# EAGLE design 6WLS-40W (EAGLE 7.4.0)
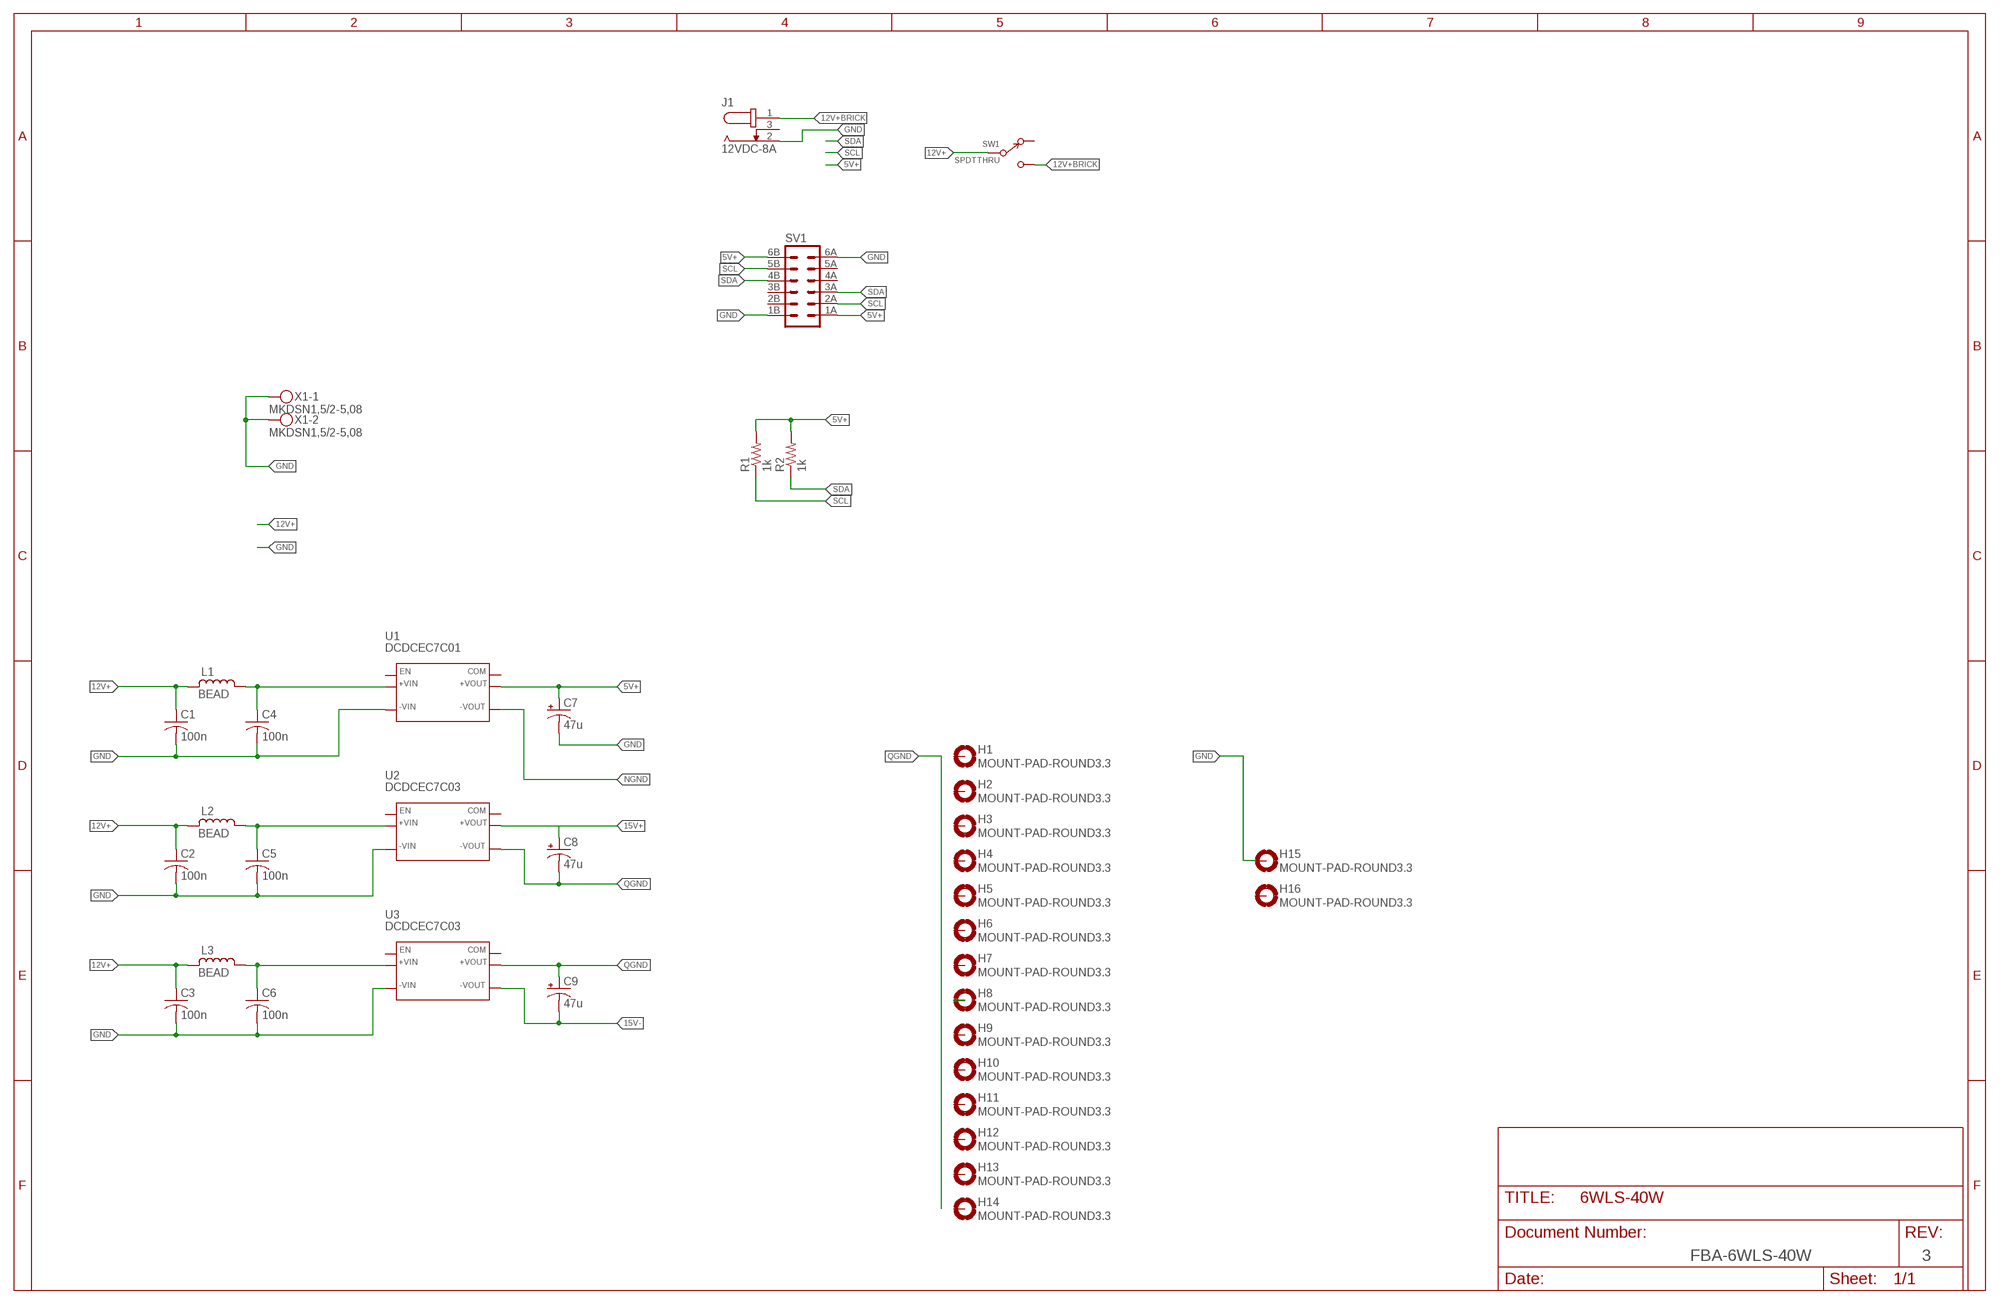
[diagram p0: schematic, sheet 1]

## Parts
C1  100n  C-US050-025X075  [C050-025X075]
C2  100n  C-US050-025X075  [C050-025X075]
C3  100n  C-US050-025X075  [C050-025X075]
C4  100n  C-US050-025X075  [C050-025X075]
C5  100n  C-US050-025X075  [C050-025X075]
C6  100n  C-US050-025X075  [C050-025X075]
C7  47u  CPOL-USE5-6  [E5-6]
C8  47u  CPOL-USE5-6  [E5-6]
C9  47u  CPOL-USE5-6  [E5-6]
H1  MOUNT-PAD-ROUND3.3  [3,3-PAD]
H2  MOUNT-PAD-ROUND3.3  [3,3-PAD]
H3  MOUNT-PAD-ROUND3.3  [3,3-PAD]
H4  MOUNT-PAD-ROUND3.3  [3,3-PAD]
H5  MOUNT-PAD-ROUND3.3  [3,3-PAD]
H6  MOUNT-PAD-ROUND3.3  [3,3-PAD]
H7  MOUNT-PAD-ROUND3.3  [3,3-PAD]
H8  MOUNT-PAD-ROUND3.3  [3,3-PAD]
H9  MOUNT-PAD-ROUND3.3  [3,3-PAD]
H10  MOUNT-PAD-ROUND3.3  [3,3-PAD]
H11  MOUNT-PAD-ROUND3.3  [3,3-PAD]
H12  MOUNT-PAD-ROUND3.3  [3,3-PAD]
H13  MOUNT-PAD-ROUND3.3  [3,3-PAD]
H14  MOUNT-PAD-ROUND3.3  [3,3-PAD]
H15  MOUNT-PAD-ROUND3.3  [3,3-PAD]
H16  MOUNT-PAD-ROUND3.3  [3,3-PAD]
J1  12VDC-8A  BARREL55  [BARREL]
L1  BEAD  L  [BEAD]
L2  BEAD  L  [BEAD]
L3  BEAD  L  [BEAD]
R1  1k  R-US_0207/7  [0207/7]
R2  1k  R-US_0207/7  [0207/7]
SV1  MA06-2CARD  [EBC06DRAS]
SW1  SPDTTHRU  [SPDT-THRU]
U1  DCDCEC7C01  [EC7C]
U2  DCDCEC7C03  [EC7C]
U3  DCDCEC7C03  [EC7C]
X1  MKDSN1,5/2-5,08  [MKDSN1,5/2-5,08]

## Nets
5V+: C7.+ R1.2 R2.2 SV1.1A SV1.6B U1.S+(+VOUT) U1.VO+(+VOUT)
12V+: C1.1 C2.1 C3.1 L1.1 L2.1 L3.1 SW1.C
12V+BRICK: J1.1 SW1.1
15V+: C8.+ U2.S+(+VOUT) U2.VO+(+VOUT)
15V-: C9.- U3.S-(-VOUT) U3.VO-(-VOUT)
GND: C1.2 C2.2 C3.2 C4.2 C5.2 C6.2 C7.- H15.B3,3(MOUNT) J1.2 SV1.1B SV1.6A U1.VIN-(-VIN) U2.VIN-(-VIN) U3.VIN-(-VIN) X1.1 X1.2
N$1: C5.1 L2.2 U2.VIN+(+VIN)
N$2: C6.1 L3.2 U3.VIN+(+VIN)
N$3: C4.1 L1.2 U1.VIN+(+VIN)
N$5: H8.B3,3(MOUNT)
NGND: U1.S-(-VOUT) U1.VO-(-VOUT)
QGND: C8.- C9.+ U2.S-(-VOUT) U2.VO-(-VOUT) U3.S+(+VOUT) U3.VO+(+VOUT)
SCL: R1.1 SV1.2A SV1.5B
SDA: R2.1 SV1.3A SV1.4B
Unconnected: H1.B3,3(MOUNT) H2.B3,3(MOUNT) H3.B3,3(MOUNT) H4.B3,3(MOUNT) H5.B3,3(MOUNT) H6.B3,3(MOUNT) H7.B3,3(MOUNT) H9.B3,3(MOUNT) H10.B3,3(MOUNT) H11.B3,3(MOUNT) H12.B3,3(MOUNT) H13.B3,3(MOUNT) H14.B3,3(MOUNT) H16.B3,3(MOUNT) J1.3 SV1.2B SV1.3B SV1.4A SV1.5A SW1.2 U1.ONOFF(EN) U2.ONOFF(EN) U3.ONOFF(EN)

## Notes on the sheet
- FBA-6WLS-40W | 3

## Power pins joined to a net without a drawn wire
COM: U1.NC(COM) U2.NC(COM) U3.NC(COM)

## Library data of the parts
C1-C6 = resistor:C-US: CAPACITOR, American symbol
C7-C9 = resistor:CPOL-US: POLARIZED CAPACITOR, American symbol
H1-H16 = holes:MOUNT-PAD-ROUND: MOUNTING PAD, round
J1 = studio_h:BARREL: DC POWER JACK Power Jack, DC, Right Angle, Through Hole 8A; MF: TENSILITY; MPN: 54-00167; Z_DIGIKEY: 839-54-00167-ND; Z_SMT: N
L1-L3 = studio_h:L: Inductor; MF: LAIRD; MPN: 28L0138-80R-10; Z_DIGIKEY: 240-2513-2-ND; Z_SMT: N
R1 R2 = resistor:R-US_: RESISTOR, American symbol
SV1 = studio_h:MA06-2: PIN HEADER; MF: SULLINS; MPN: EBC06DRAS; Z_DIGIKEY: S3294-ND
SW1 = studio_h:SPDT: SPDT Switch; MF: NKK; MPN: MS13ASG30; Z_DIGIKEY: MS13ASG30-ND
U1-U3 = studio_h:DCDC: DCDC Converter
X1 = con-phoenix-508:MKDSN1,5/2-5,08: MKDSN 1,5/ 2-5,08 Printklemme Nennstrom: 13,5 A Nennspannung: 250 V Rastermaß: 5,08 mm Polzahl: 2 Anschlussart: Schraubanschluss Montage: Löten Anschlussrichtung Leiter/Platine: 0 ° Artikelnummer: 1729128 Source: http://eshop.phoenixcontact.com .. 1729128.pdf

## Net classes
0 Signal: width 0.254 mm, clearance 0.205 mm
1 Power: width 0.508 mm, clearance 0.205 mm to class 0, clearance 0.205 mm
2 GND: width 0.889 mm

## Board
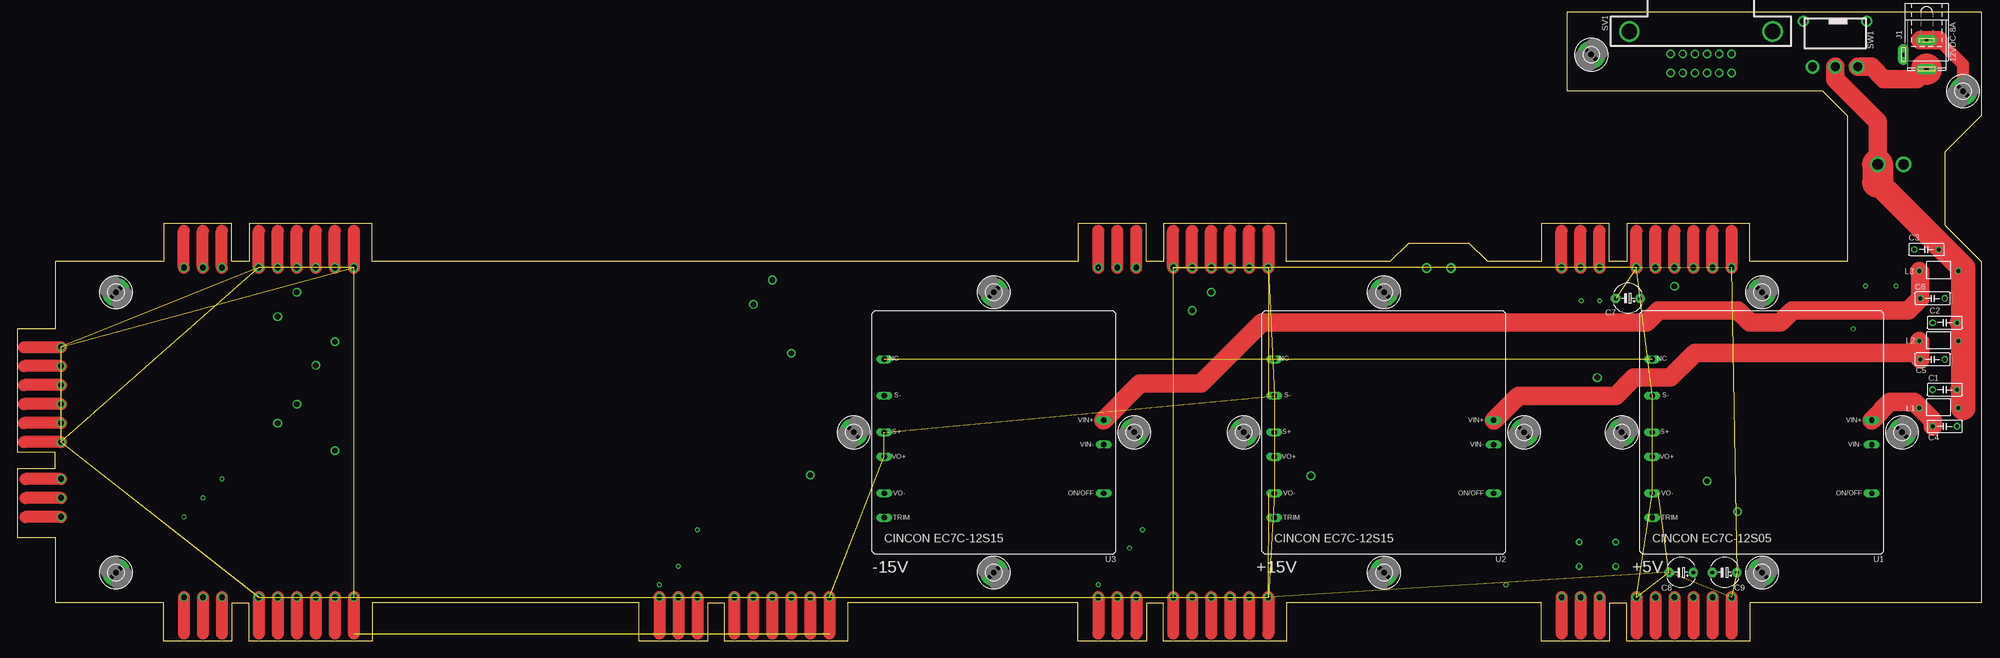
[diagram p1: board, top side]
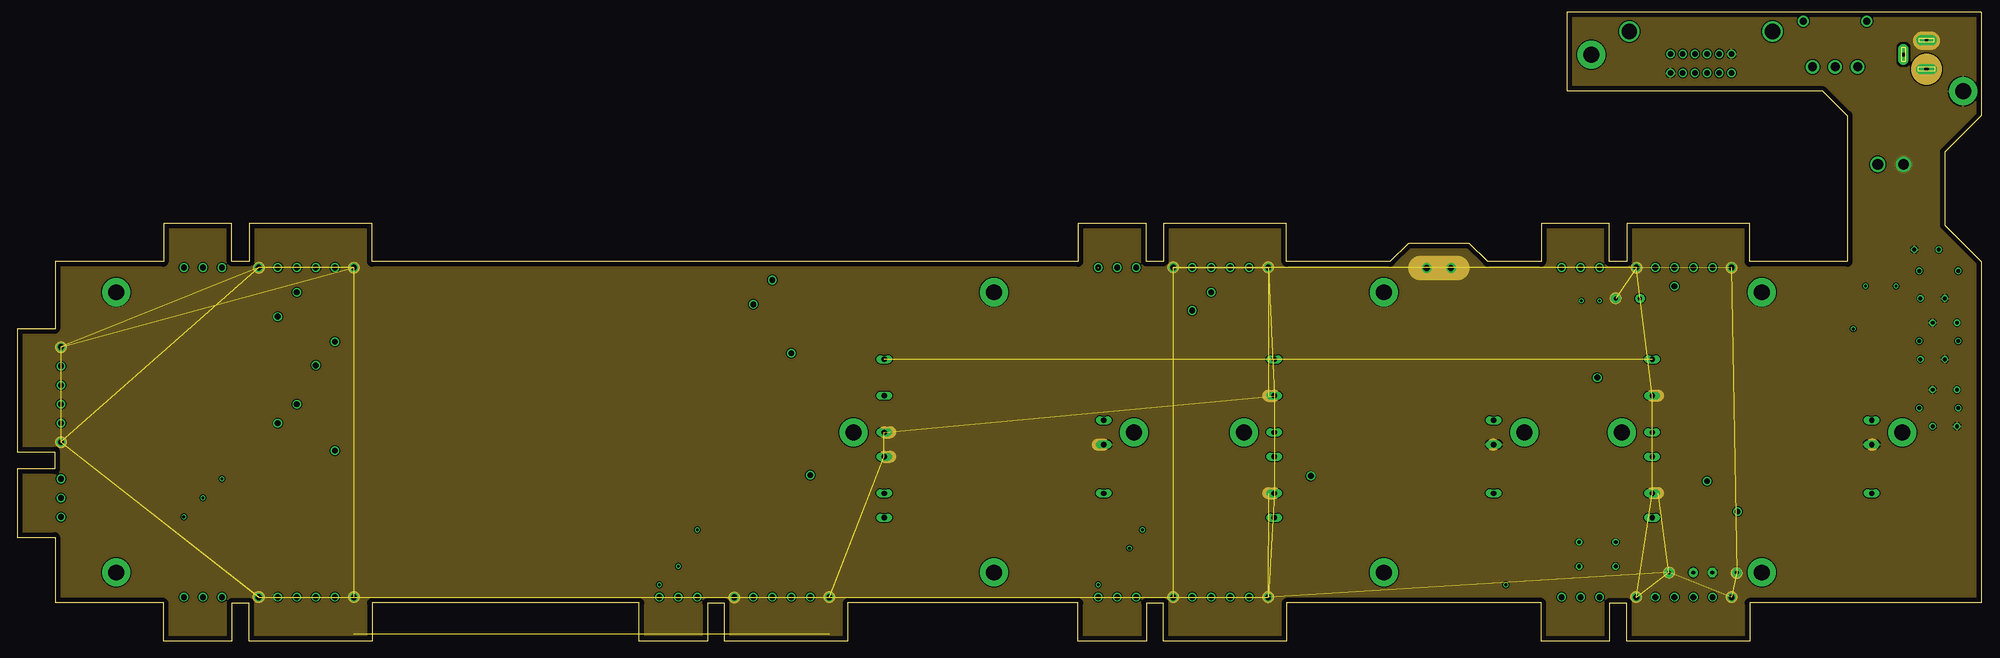
[diagram p2: board, inner layer Route2]
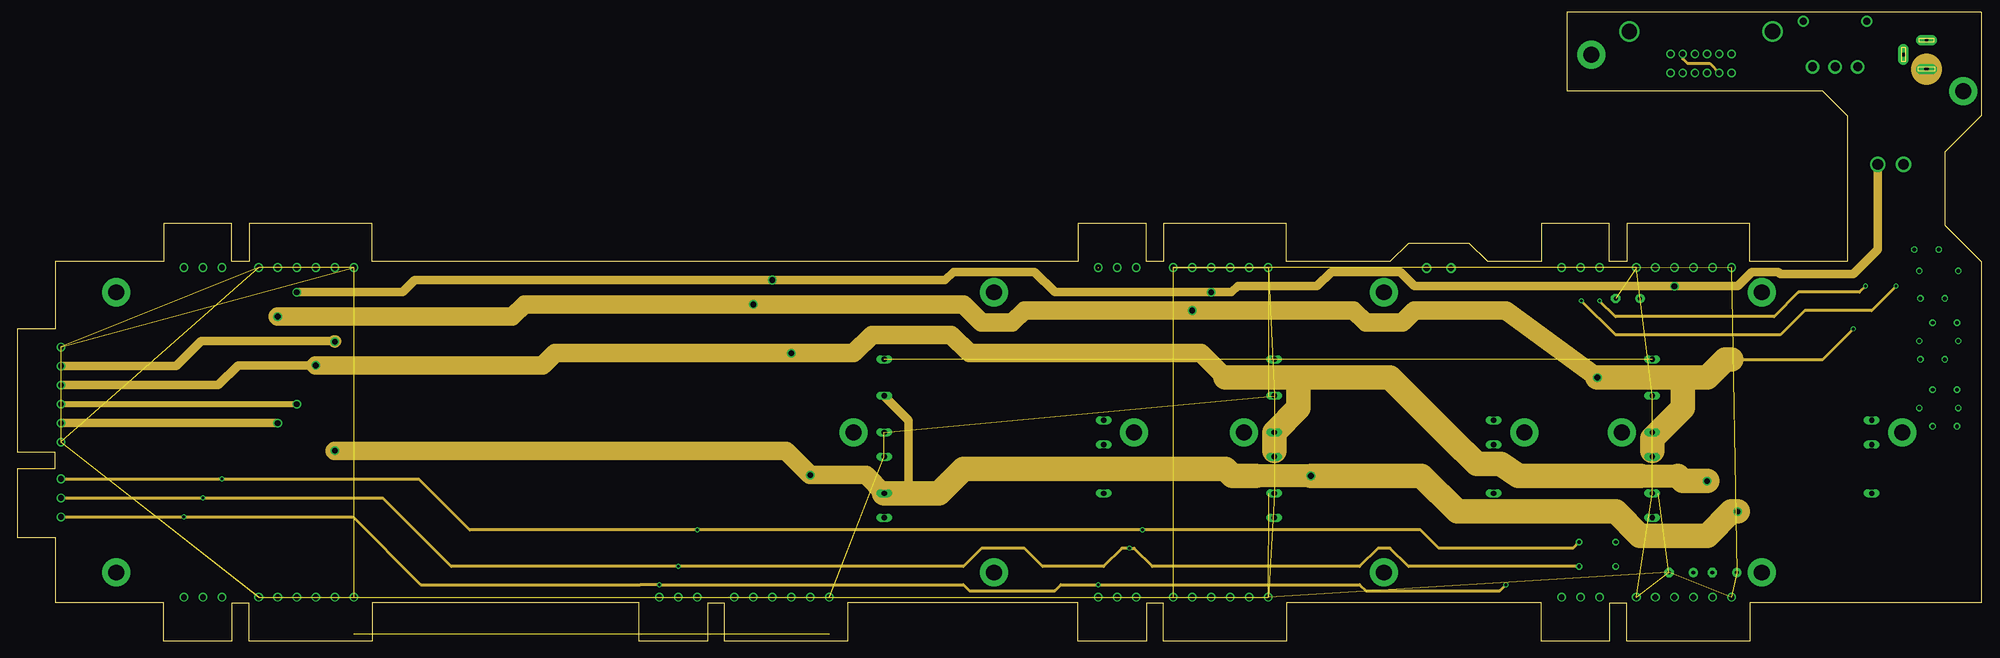
[diagram p3: board, inner layer Route15]
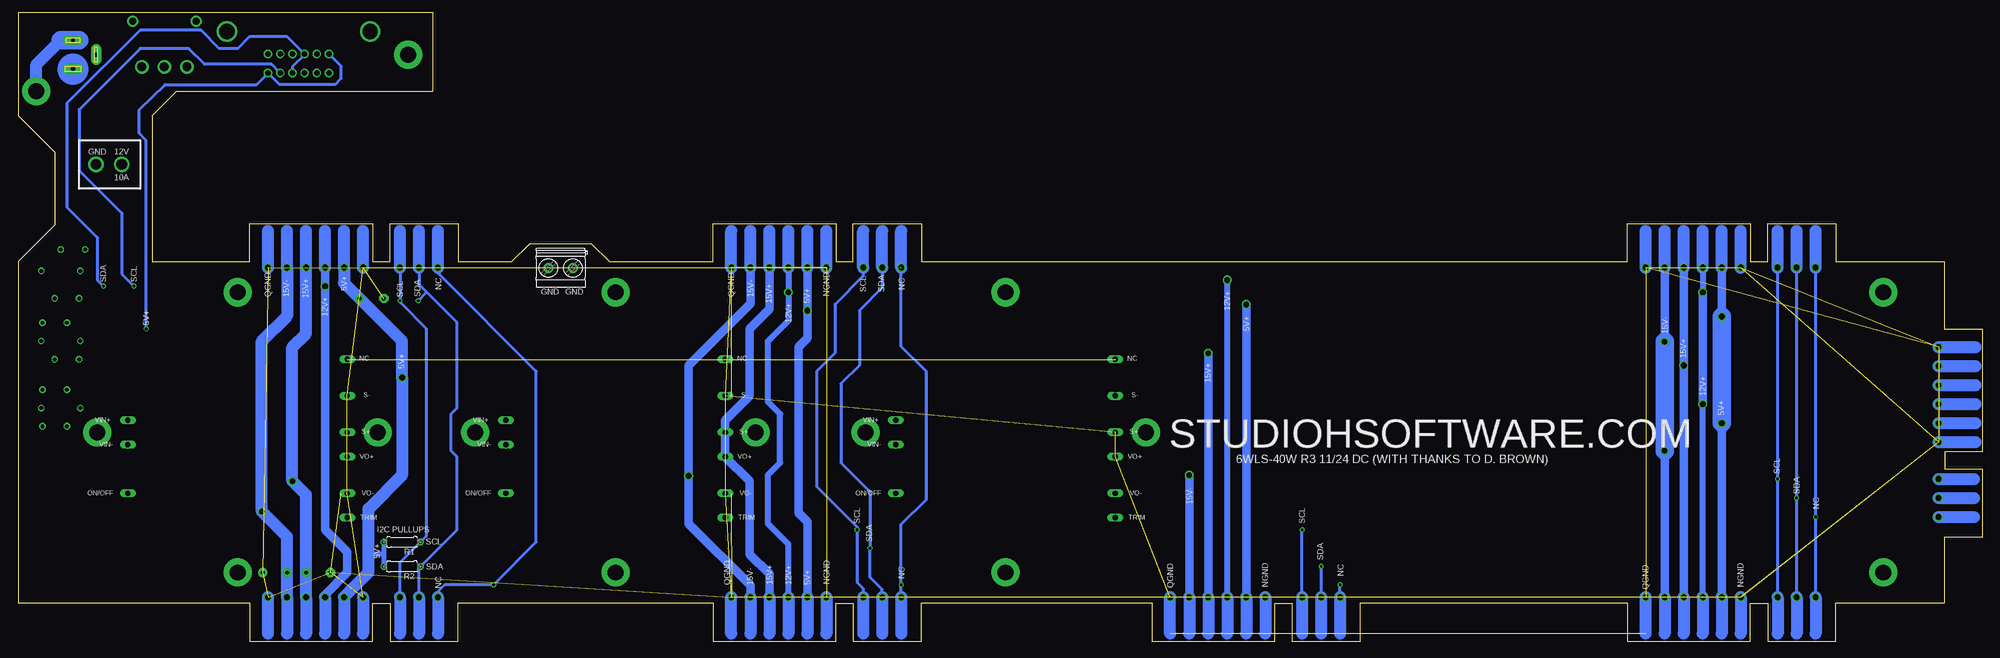
[diagram p4: board, bottom side, seen from below]

Size 409.26 x 131.13 mm. Coordinates in mm from the lower left corner, seen from the top.
Outline: 73.98,7.94 73.98,0 48.32,0 48.32,7.87 44.77,7.87 44.77,0 30.54,0 30.54,7.94 7.94,7.94 7.94,21.65 0,21.65 0,35.88 7.87,35.88 7.87,39.43 0,39.43 0,65.09 7.94,65.09 7.94,79.06 30.54,79.06 30.54,87 44.77,87 44.77,79.12 48.32,79.12 48.32,87 73.98,87 73.98,79.06 221.04,79.06 221.04,87 235.27,87 235.27,79.12 238.82,79.12 238.82,87 264.48,87 264.48,79.06 286.07,79.06 289.88,82.87 302.58,82.87 306.39,79.06 317.56,79.06 317.56,87 331.79,87 331.79,79.12 335.34,79.12 335.34,87 361,87 361,79.06 381.32,79.06 381.32,109.54 376.24,114.62 322.9,114.62 322.9,131.13 409.26,131.13 409.26,109.54 401.64,101.92 401.64,86.68 409.26,79.06 409.26,7.94 361,7.94 361,0 335.34,0 335.34,7.87 331.79,7.87 331.79,0 317.56,0 317.56,7.94 264.48,7.94 264.48,0 238.82,0 238.82,7.87 235.27,7.87 235.27,0 221.04,0 221.04,7.94 173.04,7.94 173.04,0 147.38,0 147.38,7.87 143.83,7.87 143.83,0 129.6,0 129.6,7.94 73.98,7.94
Copper layers (1*2*15*16): Top 0.035mm / dielectric 0.2mm / Route2 0.035mm / dielectric 1mm / Route15 0.035mm / dielectric 0.2mm / Bottom 0.035mm
Design rules "default *": minimum track width 10mil, minimum drill 20mil, track to track 8mil, track to pad 8mil, pad to pad 8mil, via to via 8mil, smd to smd 8mil, copper to edge 40mil, drill to drill 8mil, minimum pad ring 10mil, minimum via ring 8mil, stop-mask expansion 4mil, vias tented up to drill 0mil, thermal gap 10mil

### Footprints (pad centres in the part's own frame; a part is rotated, then mirrored left to right if it is on the bottom)
C050-025X075 = drill 0.813 octagon: 1 -2.54,0; 2 2.54,0
E5-6 = drill 0.813 pad 1.905: + -2.54,0 | drill 0.813 pad 1.905 octagon: - 2.54,0
3,3-PAD = drill 3.3 pad 5.842: B3,3 0,0
BARREL = drill 1 pad 2.184 long: 1 6.81,0 | drill 0.8 pad 2.184 long: 2 0.81,0; 3 3.81,-4.8
BEAD = drill 0.813: 1 -4.064,0; 2 4.064,0
0207/7 = drill 0.813 octagon: 1 -3.81,0; 2 3.81,0
EBC06DRAS = drill 1.143: 1A -6.35,-6.223; 1B -6.35,-10.185; 2A -3.81,-6.223; 2B -3.81,-10.185; 3A -1.27,-6.223; 3B -1.27,-10.185; 4A 1.27,-6.223; 4B 1.27,-10.185; 5A 3.81,-6.223; 5B 3.81,-10.185; 6A 6.35,-6.223; 6B 6.35,-10.185 | drill 3.175: M1 -14.935,-1.524; M2 14.91,-1.524
SPDT-THRU = drill 1.854: 1 4.699,-6.35; 2 -4.699,-6.35; C 0,-6.35 | drill 1.499: P$4 6.604,3.175; P$5 -6.604,3.175
EC7C = drill 1.1 long: NC 22.86,-16.51; ONOFF -22.86,11.43; S+ 22.86,-1.27; S- 22.86,-8.89; TRIM 22.86,16.51; VIN+ -22.86,-3.81; VIN- -22.86,1.27; VO+ 22.86,3.81; VO- 22.86,11.43
MKDSN1,5/2-5,08 = drill 1.3 pad 2: 1 -2.561,0.025; 2 2.519,0.025

### Placement (x,y rotation side)
C1  401.64,52.39 180 top
C2  401.64,66.36 180 top
C3  397.83,81.6 180 top
C4  401.64,44.77 0 top
C5  399.1,58.74 0 top
C6  399.1,71.44 0 top
C7  335.6,71.44 180 top
C8  346.72,14.29 180 top
C9  355.77,14.29 180 top
H1  203.52,72.71 270 top
H2  203.52,14.29 270 top
H3  20.64,72.71 270 top
H4  20.64,14.29 270 top
H5  334.33,43.5 0 top
H6  314.01,43.5 0 top
H7  284.8,72.71 0 top
H8  284.8,14.29 0 top
H9  363.54,72.71 0 top
H10  363.54,14.29 0 top
H11  255.59,43.5 0 top
H12  232.73,43.5 0 top
H13  174.31,43.5 0 top
H14  392.75,43.5 0 top
H15  405.45,114.62 0 top
H16  327.98,122.24 0 top
J1  397.83,126.05 270 top
L1  400.37,48.58 180 top
L2  400.37,62.55 180 top
L3  400.37,77.15 180 top
R1  329.25,20.64 180 bottom
R2  329.25,15.56 180 bottom
SV1  350.84,128.59 0 top
SW1  378.78,126.05 0 top
U1  363.54,42.23 180 top
U2  284.8,42.23 180 top
U3  203.52,42.23 180 top
X1  296.23,77.79 180 bottom

### Tracks (layer width: path | path; a pad name or v marks a point on that pad's centre or on a via)
5V+  (via drill 0.6, 1.2)  (1 unrouted)
  Top 2.54: v54.32,9.14 54.32,1.52 | v54.32,77.85 54.32,85.5 | v9.14,45.43 1.49,45.43 | v153.38,9.14 153.38,1.52 | v244.82,9.14 244.82,1.52 | v244.82,77.85 244.82,85.5 | v341.34,9.14 341.34,1.52 | v341.34,77.85 341.34,85.5
  Route15 0.61: 357.19,58.74 376.24,58.74 v382.59,65.09
  Route15 1.778: v9.14,45.43 v54.32,45.43
  Route15 2.54: U1.VO+ 340.73,39.69
  Route15 3.81: v329.25,54.93 310.2,68.9 291.15,68.9 288.61,66.36 280.99,66.36 278.45,68.9 v244.82,68.9 209.87,68.9 207.33,66.36 200.98,66.36 197.17,70.17 v153.38,70.17 105.73,70.17 103.19,67.63 v54.32,67.63
  Route15 5.08: 357.19,58.74 355.92,58.74 352.11,54.93 347.03,54.93 | v329.25,54.93 347.03,54.93 | 340.73,39.69 340.73,42.28 347.03,48.58 347.03,54.93
  Bottom 0.61: SV1.1A 341.95,119.82 341.95,117.28 343.22,116.01 354.8,116.01 SV1.6B 359.58,116.01 378.65,116.01 383.98,110.81 383.98,105.85 382.71,104.46 382.71,65.21 v382.59,65.09
  Bottom 1.016: R1.2 333.06,18.1 | 333.06,18.1 R2.2 | 333.06,18.1 336.26,18.1
  Bottom 1.27: 54.32,38.42 v54.32,45.43
  Bottom 1.778: v54.32,9.14 v54.32,45.43 | v54.32,77.85 v54.32,67.63 | v153.38,9.14 v153.38,70.17 | v244.82,77.85 v244.82,68.9 244.82,63.16 246.7,61.28 246.7,26.73 244.82,24.85 v244.82,9.14
  Bottom 2.54: v54.32,9.14 54.32,1.52 | v54.32,77.85 54.32,85.5 | v9.14,45.43 1.49,45.43 | v153.38,9.14 153.38,1.52 | v244.82,9.14 244.82,1.52 | v244.82,77.85 244.82,85.5 | 341.34,1.52 v341.34,9.14 341.34,9.21 336.26,14.29 336.26,18.1 336.26,27.6 329.25,34.61 v329.25,54.93 329.25,62.55 C7.+ 341.34,74.64 v341.34,77.85 341.34,85.5
  Bottom 3.81: v54.32,67.63 v54.32,45.43
12V+  (via drill 1.2, 2.2)
  Top 2.54: v58.28,9.14 58.28,1.52 | v58.28,77.85 58.28,85.5 | v9.14,49.39 1.49,49.39 | v248.78,9.14 248.78,1.52 | v248.78,77.85 248.78,85.5 | v345.3,9.14 345.3,1.52 | v345.3,77.85 345.3,85.5 | v157.34,9.14 157.34,1.52 | C3.1 401,82.23 | L3.1 404.81,77.15 405.45,77.79 | C2.1 403.9,66.36 403.85,66.41 405.4,66.41 405.45,66.36 | 404.18,62.55 L2.1 405.45,62.55 | C1.1 404.05,52.39 403.97,52.46 404.1,52.46 C1.1 | C1.1 405.45,52.39 | 404.18,48.58 L1.1 405.45,48.58
  Top 3.81: SW1.C 378.78,117.16 387.67,108.27 v387.67,99.38
  Top 5.08: 405.45,48.58 405.45,52.39 405.45,62.55 405.45,66.36 405.45,77.79 401,82.23 387.67,95.57
  Top 6.452: v387.67,99.38 387.67,95.57
  Route15 1.27: v9.14,49.39 v58.28,49.39
  Route15 1.778: v387.67,99.38 387.67,81.6 382.59,76.52 367.35,76.52 366.92,76.95 361.43,76.95 358.46,73.98 v345.3,73.98 291.15,73.98 288.18,76.95 273.8,76.95 270.83,73.98 254.32,73.98 253.05,72.71 v248.78,72.71 216.22,72.71 211.98,76.95 195.06,76.95 193.36,75.25 v157.34,75.25 82.87,75.25 80.33,72.71 v58.28,72.71
  Bottom 1.27: v58.28,9.14 v58.28,49.39 | v58.28,77.85 v58.28,72.71 | v248.78,9.14 248.78,20.18 253.05,24.45 253.05,34.61 250.51,37.15 250.51,47.31 253.05,49.85 253.05,62.55 248.78,66.81 v248.78,72.71 v248.78,77.85 | v157.34,9.14 v157.34,75.25
  Bottom 1.778: v58.28,49.39 v58.28,72.71 | v345.3,9.14 345.3,9.66 340.68,14.29 340.68,18.61 345.3,23.18 v345.3,73.98 v345.3,77.85
  Bottom 2.54: v58.28,9.14 58.28,1.52 | v58.28,77.85 58.28,85.5 | v9.14,49.39 1.49,49.39 | v248.78,9.14 248.78,1.52 | v248.78,77.85 248.78,85.5 | v345.3,9.14 345.3,1.52 | v345.3,77.85 345.3,85.5 | v157.34,9.14 157.34,1.52
12V+BRICK
  Top 3.81: SW1.1 386.4,119.7 388.94,117.16 395.75,117.16 J1.1
  Top 6.452: 397.83,119.19 J1.1
  Route2 6.452: 397.83,119.19 J1.1
  Route15 6.452: 397.83,119.19 J1.1
  Bottom 6.452: 397.83,119.19 J1.1
15V+  (via drill 1.2)
  Top 2.54: v62.24,9.14 62.24,1.52 | v62.24,77.85 62.24,85.5 | v9.14,53.35 1.49,53.35 | v161.3,9.14 161.3,1.52 | v252.74,9.14 252.74,1.52 | v252.74,77.85 252.74,85.5 | v349.26,9.14 349.26,1.52 | v349.26,77.85 349.26,85.5
  Route15 1.778: v9.14,53.35 41.92,53.35 46.04,57.47 v62.24,57.47
  Route15 2.54: U2.VO+ 261.94,39.69
  Route15 3.81: v62.24,57.47 109.54,57.47 112.08,60.01 v161.3,60.01 174.31,60.01 178.12,63.82 194.63,63.82 198.44,60.01 246.7,60.01 251.78,54.93
  Route15 4.826: 338.33,34.42 346.01,34.42
  Route15 5.08: 338.33,34.42 312.74,34.42 309.12,36.96 304.1,36.96 298.77,42.23 286.07,54.93 267.02,54.93 | 346.01,34.42 347.03,33.34 v352.11,33.34 | 267.02,54.93 251.78,54.93 | 261.94,39.69 U2.S+ 267.02,48.58 267.02,54.93
  Bottom 1.778: v62.24,9.14 v62.24,57.47 v62.24,77.85 | v161.3,9.14 v161.3,60.01 | v252.74,9.14 252.74,13.98 256.86,18.1 256.86,33.34 U2.VO+ 261.94,46.04 256.86,51.12 256.86,65.09 252.74,69.2 v252.74,77.85
  Bottom 2.54: v62.24,9.14 62.24,1.52 | v62.24,77.85 62.24,85.5 | v9.14,53.35 1.49,53.35 | v161.3,9.14 161.3,1.52 | v252.74,9.14 252.74,1.52 | v252.74,77.85 252.74,85.5 | 349.26,1.52 v349.26,9.14 C8.+ 349.26,30.49 v352.11,33.34 352.11,61.28 349.26,64.12 v349.26,77.85 349.26,85.5
15V-  (via drill 1.2)
  Top 2.54: v66.21,9.14 66.21,1.52 | v66.21,77.85 66.21,85.5 | v9.14,57.32 1.49,57.32 | v165.27,9.14 165.27,1.52 | v256.71,9.14 256.71,1.52 | v256.71,77.85 256.71,85.5 | v353.23,9.14 353.23,1.52 | v353.23,77.85 353.23,85.5
  Route15 1.778: v9.14,57.32 33.19,57.32 38.42,62.55 66.05,62.55 | U3.S- 185.74,46.04 185.74,29.53 187.01,30.8
  Route15 2.54: 66.36,62.55 v66.21,62.4 66.05,62.55
  Route15 3.81: v66.21,39.69 160.19,39.69 v165.27,34.61 176.85,34.61 U3.VO-
  Route15 4.826: v269.56,34.42 258.13,34.42
  Route15 5.08: v269.56,34.42 292.6,34.42 300.04,26.99 333.06,26.99 338.14,21.91 352.11,21.91 357.19,26.99 v358.46,26.99 | 258.13,34.42 253.24,34.42 251.78,35.88 197.17,35.88 192.09,30.8 187.01,30.8 U3.VO-
  Bottom 0.406: C9.- 353.38,14.29 353.38,11.75 353.23,11.75
  Bottom 1.778: v66.21,9.14 v66.21,39.69 | v66.21,77.85 v66.21,62.4 | v165.27,9.14 v165.27,34.61 | v256.71,9.14 256.71,11.6 269.56,24.45 v269.56,34.42 269.56,57.47 256.71,70.32 v256.71,77.85
  Bottom 2.54: v66.21,9.14 66.21,1.52 | v66.21,77.85 66.21,85.5 | v9.14,57.32 1.49,57.32 | v165.27,9.14 165.27,1.52 | v256.71,9.14 256.71,1.52 | v256.71,77.85 256.71,85.5 | 353.23,1.52 v353.23,9.14 353.23,11.75 C9.- 353.23,21.76 v358.46,26.99 358.46,62.55 353.23,67.78 v353.23,77.85 353.23,85.5
  Bottom 3.81: v66.21,39.69 v66.21,62.4
COM  (2 unrouted)
GND  (via drill 2.2)  (18 unrouted)
  Top 2.54: H15.B3,3 405.45,120.16 400.37,125.24
  Top 3.81: 400.37,125.24 J1.2 396.56,125.24
  Top 5.08: 405.19,114.62 H15.B3,3 405.45,114.36
  Route2 0.61: 396.94,125.16 397.75,125.16 J1.2
  Route2 2.54: 386.65,40.96 U1.VIN- | 341.95,30.8 340.68,30.8 | U2.VIN- 307.4,40.96 | 225.11,40.96 U3.VIN- | 180.66,43.5 181.93,43.5 | 169.23,9.21 169.25,9.21 | 149.39,9.11 149.42,9.11 | 50.33,9.18 50.36,9.18 | 70.14,9.16 70.17,9.16 | 9.13,41.49 9.16,41.49 | 9.13,61.25 9.16,61.25 | 50.36,77.84 50.38,77.84 | 70.17,77.84 70.19,77.84 | 240.86,77.86 240.88,77.86 | 260.67,77.86 260.69,77.86 | 240.83,9.13 240.86,9.13 | 260.64,9.13 260.67,9.13 | 337.32,9.16 337.35,9.16 | 357.16,9.13 357.19,9.13 | 337.38,77.79 337.4,77.79 | 357.21,77.81 357.24,77.81 | 358.28,14.21 358.25,14.21 | 344.16,14.31 344.18,14.31 | 333.06,71.41 333.08,71.41 | 341.95,51.12 340.68,51.12 | 260.67,30.8 261.94,30.8 | 260.67,51.12 261.94,51.12 | 180.66,38.42 181.93,38.42
  Route2 3.81: 396.94,125.16 398.72,125.16
  Route2 5.08: H15.B3,3 405.19,114.62 | 300.04,77.79 292.42,77.79
  Bottom 2.54: 400.37,125.24 405.45,120.16 H15.B3,3
  Bottom 3.81: 396.56,125.24 J1.2 400.37,125.24
  Bottom 5.08: 405.19,114.62 H15.B3,3 405.45,114.36
  other vias: 393,99.38
  pour Route2: 7.94,79.06 7.94,65.09 0.32,65.09 0.32,21.91 7.94,21.91 7.94,7.94 30.8,7.94 30.8,0.32 73.98,0.32 73.98,7.94 129.86,7.94 129.86,0.32 173.04,0.32 173.04,7.94 221.3,7.94 221.3,0.32 264.48,0.32 264.48,7.94 317.82,7.94 317.82,0.32 361,0.32 361,7.94 409.26,7.94 409.26,131.13 322.9,131.13 322.9,114.62 374.97,114.62 374.97,109.54 381.32,109.54 381.32,79.06 361,79.06 361,86.68 317.82,86.68 317.82,79.06 306.39,79.06 306.39,82.87 286.07,82.87 286.07,79.06 264.48,79.06 264.48,86.68 221.3,86.68 221.3,79.06 73.98,79.06 73.98,86.68 30.8,86.68 30.8,79.06
N$1
  Top 3.81: U2.VIN+ 312.74,51.12 333.06,51.12 336.87,54.93 344.49,54.93 349.57,60.01 396.56,60.01 | C5.1 396.56,60.01 | 396.56,60.01 396.56,62.29 L2.2
N$2
  Top 3.81: U3.VIN+ 234,53.66 246.7,53.66 259.4,66.36 339.41,66.36 341.95,68.9 358.46,68.9 361,66.36 367.35,66.36 369.89,68.9 394.02,68.9 C6.1 396.56,76.9 L3.2
N$3
  Top 2.54: L1.2 396.3,48.83 395.92,49.21
  Top 3.81: U1.VIN+ 390.21,49.85 395.29,49.85 395.92,49.21 399.1,46.04 C4.1
NC  (via drill 0.6, 1.2)  (1 unrouted)
  Top 2.54: v34.76,9.14 34.76,1.52 | v34.76,77.85 34.76,85.5 | v9.14,25.87 1.75,25.87 | v133.82,9.14 133.82,1.52 | v225.26,9.14 225.26,1.52 | v225.26,77.85 225.26,85.5 | v321.78,9.14 321.78,1.52 | v321.78,77.85 321.78,85.5
  Route15 0.61: v9.14,25.87 v34.76,25.87 70.02,25.87 84.14,11.75 129.86,11.75 v133.82,11.75 197.17,11.75 198.44,10.48 216.22,10.48 217.49,11.75 v225.26,11.75 279.72,11.75 280.99,10.48 308.93,10.48 v310.2,11.75
  Bottom 0.61: v34.76,9.14 v34.76,25.87 v34.76,77.85 | v133.82,9.14 v133.82,11.75 | v225.26,9.14 v225.26,11.75 225.26,24.3 220.03,29.53 220.03,56.2 225.26,61.43 225.26,77.79 | v321.78,9.14 321.78,10.33 320.36,11.75 v310.2,11.75 301.31,20.64 301.31,56.2 321.78,76.67 v321.78,77.85
  Bottom 2.54: v34.76,9.14 34.76,1.52 | v34.76,77.85 34.76,85.5 | v9.14,25.87 1.75,25.87 | v133.82,9.14 133.82,1.52 | v225.26,9.14 225.26,1.52 | v225.26,77.85 225.26,85.5 | v321.78,9.14 321.78,1.52 | v321.78,77.85 321.78,85.5
NGND  (via drill 1.2)  (9 unrouted)
  Top 2.54: v50.36,9.14 50.36,1.52 | v50.36,77.85 50.36,85.5 | v9.14,41.47 1.49,41.47 | v149.42,9.14 149.42,1.52 | v337.38,9.14 337.38,1.52 | v337.38,77.85 337.38,85.5 | v240.86,9.14 240.86,1.52 | v240.86,77.85 240.86,85.5
  Bottom 2.54: v50.36,9.14 50.36,1.52 | v50.36,77.85 50.36,85.5 | v9.14,41.47 1.49,41.47 | v149.42,9.14 149.42,1.52 | v337.38,9.14 337.38,1.52 | v337.38,77.85 337.38,85.5 | v240.86,9.14 240.86,1.52 | v240.86,77.85 240.86,85.5
QGND  (via drill 1.2)  (13 unrouted)
  Top 2.54: v70.17,9.14 70.17,1.52 | 70.17,85.5 v70.17,77.85 | 1.49,61.28 v9.14,61.28 | v169.23,9.14 169.23,1.52 | v260.67,9.14 260.67,1.52 | 260.67,85.5 v260.67,77.85 | v357.19,9.14 357.19,1.52 | 357.19,85.5 v357.19,77.85
  Bottom 2.54: 70.17,1.52 v70.17,9.14 | v70.17,77.85 70.17,85.5 | v9.14,61.28 1.49,61.28 | 169.23,1.52 v169.23,9.14 | 260.67,1.52 v260.67,9.14 | v260.67,77.85 260.67,85.5 | 357.19,1.52 v357.19,9.14 | v357.19,77.85 357.19,85.5
SCL  (via drill 0.6, 1.2)
  Top 2.54: v42.68,9.14 42.68,1.52 | v42.68,77.85 42.68,85.5 | v9.14,33.79 1.75,33.79 | v141.74,9.14 141.74,1.52 | v233.18,9.14 233.18,1.52 | v233.18,77.85 233.18,85.5 | v329.7,9.14 329.7,1.52 | v329.7,77.85 329.7,85.5
  Route15 0.61: SV1.2A 347.03,121.37 347.99,120.41 352.64,120.41 SV1.5B | R1.1 324.17,19.37 296.23,19.37 292.42,23.18 v234.45,23.18 v141.74,23.18 94.3,23.18 83.68,33.79 v42.68,33.79 v9.14,33.79 | v385.13,73.98 383.86,72.71 371.16,72.71 366.08,67.63 333.01,67.63 v329.7,70.93
  Bottom 0.61: SV1.5B 356.48,120.23 370.42,120.23 373.7,123.51 383.86,123.51 396.56,110.81 396.56,98.11 387.67,89.22 387.67,76.52 v385.13,73.98 | v329.7,9.14 329.7,16.37 R1.1 324.17,21.91 324.17,65.09 329.7,70.62 v329.7,70.93 v329.7,77.85 | v42.68,9.14 v42.68,33.79 v42.68,77.85 | v233.18,9.14 233.18,10.99 234.45,12.2 v234.45,23.18 234.45,23.76 242.89,32.19 242.89,56.2 239.08,60.01 239.08,70.17 233.18,76.06 v233.18,77.85 | v141.74,9.14 v141.74,23.18
  Bottom 2.54: v42.68,9.14 42.68,1.52 | v42.68,77.85 42.68,85.5 | v9.14,33.79 1.75,33.79 | v141.74,9.14 141.74,1.52 | v233.18,9.14 233.18,1.52 | v233.18,77.85 233.18,85.5 | v329.7,9.14 329.7,1.52 | v329.7,77.85 329.7,85.5
SDA  (via drill 0.6, 1.2)
  Top 2.54: v38.72,9.14 38.72,1.52 | v38.72,77.85 38.72,85.5 | v9.14,29.83 1.75,29.83 | v137.78,9.14 137.78,1.52 | v229.22,9.14 229.22,1.52 | v229.22,77.85 229.22,85.5 | v325.74,9.14 325.74,1.52 | v325.74,77.85 325.74,85.5
  Route15 0.61: R2.1 289.88,15.56 286.07,19.37 283.53,19.37 279.72,15.56 236.54,15.56 232.73,19.37 v231.76,19.37 230.19,19.37 226.38,15.56 213.68,15.56 209.87,19.37 200.98,19.37 197.17,15.56 v137.78,15.56 90.49,15.56 76.21,29.83 v38.72,29.83 v9.14,29.83 | v391.48,73.98 386.4,68.9 372.43,68.9 367.35,63.82 333.06,63.82 v325.95,70.93
  Bottom 0.61: SV1.4B 352.11,119.7 349.57,122.24 SV1.3A 353.25,126.05 361,126.05 363.54,123.51 367.35,123.51 371.16,127.32 383.86,127.32 399.1,112.08 399.1,90.49 392.75,84.14 392.75,75.25 v391.48,73.98 | v137.78,15.56 v137.78,9.14 | v38.72,9.14 v38.72,29.83 v38.72,77.85 | v325.74,9.14 325.74,15.25 R2.1 317.82,23.18 317.82,38.42 319.09,39.69 319.09,47.31 317.82,48.58 317.82,66.36 324.17,72.71 | 324.17,72.71 325.74,74.28 v325.74,77.85 | v229.22,77.85 229.22,73.67 234,68.9 234,57.47 237.81,53.66 237.81,37.15 231.76,31.1 v231.76,19.37 231.76,13.32 229.22,10.78 v229.22,9.14 | v325.95,70.93 324.17,72.71
  Bottom 2.54: v38.72,9.14 38.72,1.52 | v38.72,77.85 38.72,85.5 | v9.14,29.83 1.75,29.83 | v137.78,9.14 137.78,1.52 | v229.22,9.14 229.22,1.52 | v229.22,77.85 229.22,85.5 | v325.74,9.14 325.74,1.52 | v325.74,77.85 325.74,85.5

### Text on the board
tNames: CINCON EC7C-12S15 | CINCON EC7C-12S15 | CINCON EC7C-12S05 | -15V | +15V | +5V
bNames: 12V | GND | 10A | SCL | SDA | NC | SDA | SCL | NC | 5V+ | NGND | 15V- | QGND | GND | GND | SDA | SCL | 15V+ | 15V- | QGND | 5V+ | 15V+ | 12V+ | 12V+ | 12V+ | 5V+ | 5V+ | 15V- | 15V+ | 5V+ | 15V+ | 12V+ | 5V+ | STUDIOHSOFTWARE.COM | 6WLS-40W R3 11/24 DC (WITH THANKS TO D. BROWN) | SCL | SDA | 15V- | NC | SCL | SCL | I2C PULLUPS | SDA | SCL | SDA | 5V+ | SDA | NC | NC | NGND | 5V+ | 12V+ | 15V+ | 15V- | QGND | NGND | QGND | NGND | QGND | NC